# EAGLE design shield (EAGLE 8.3.2)

## Sheet 1 of 2
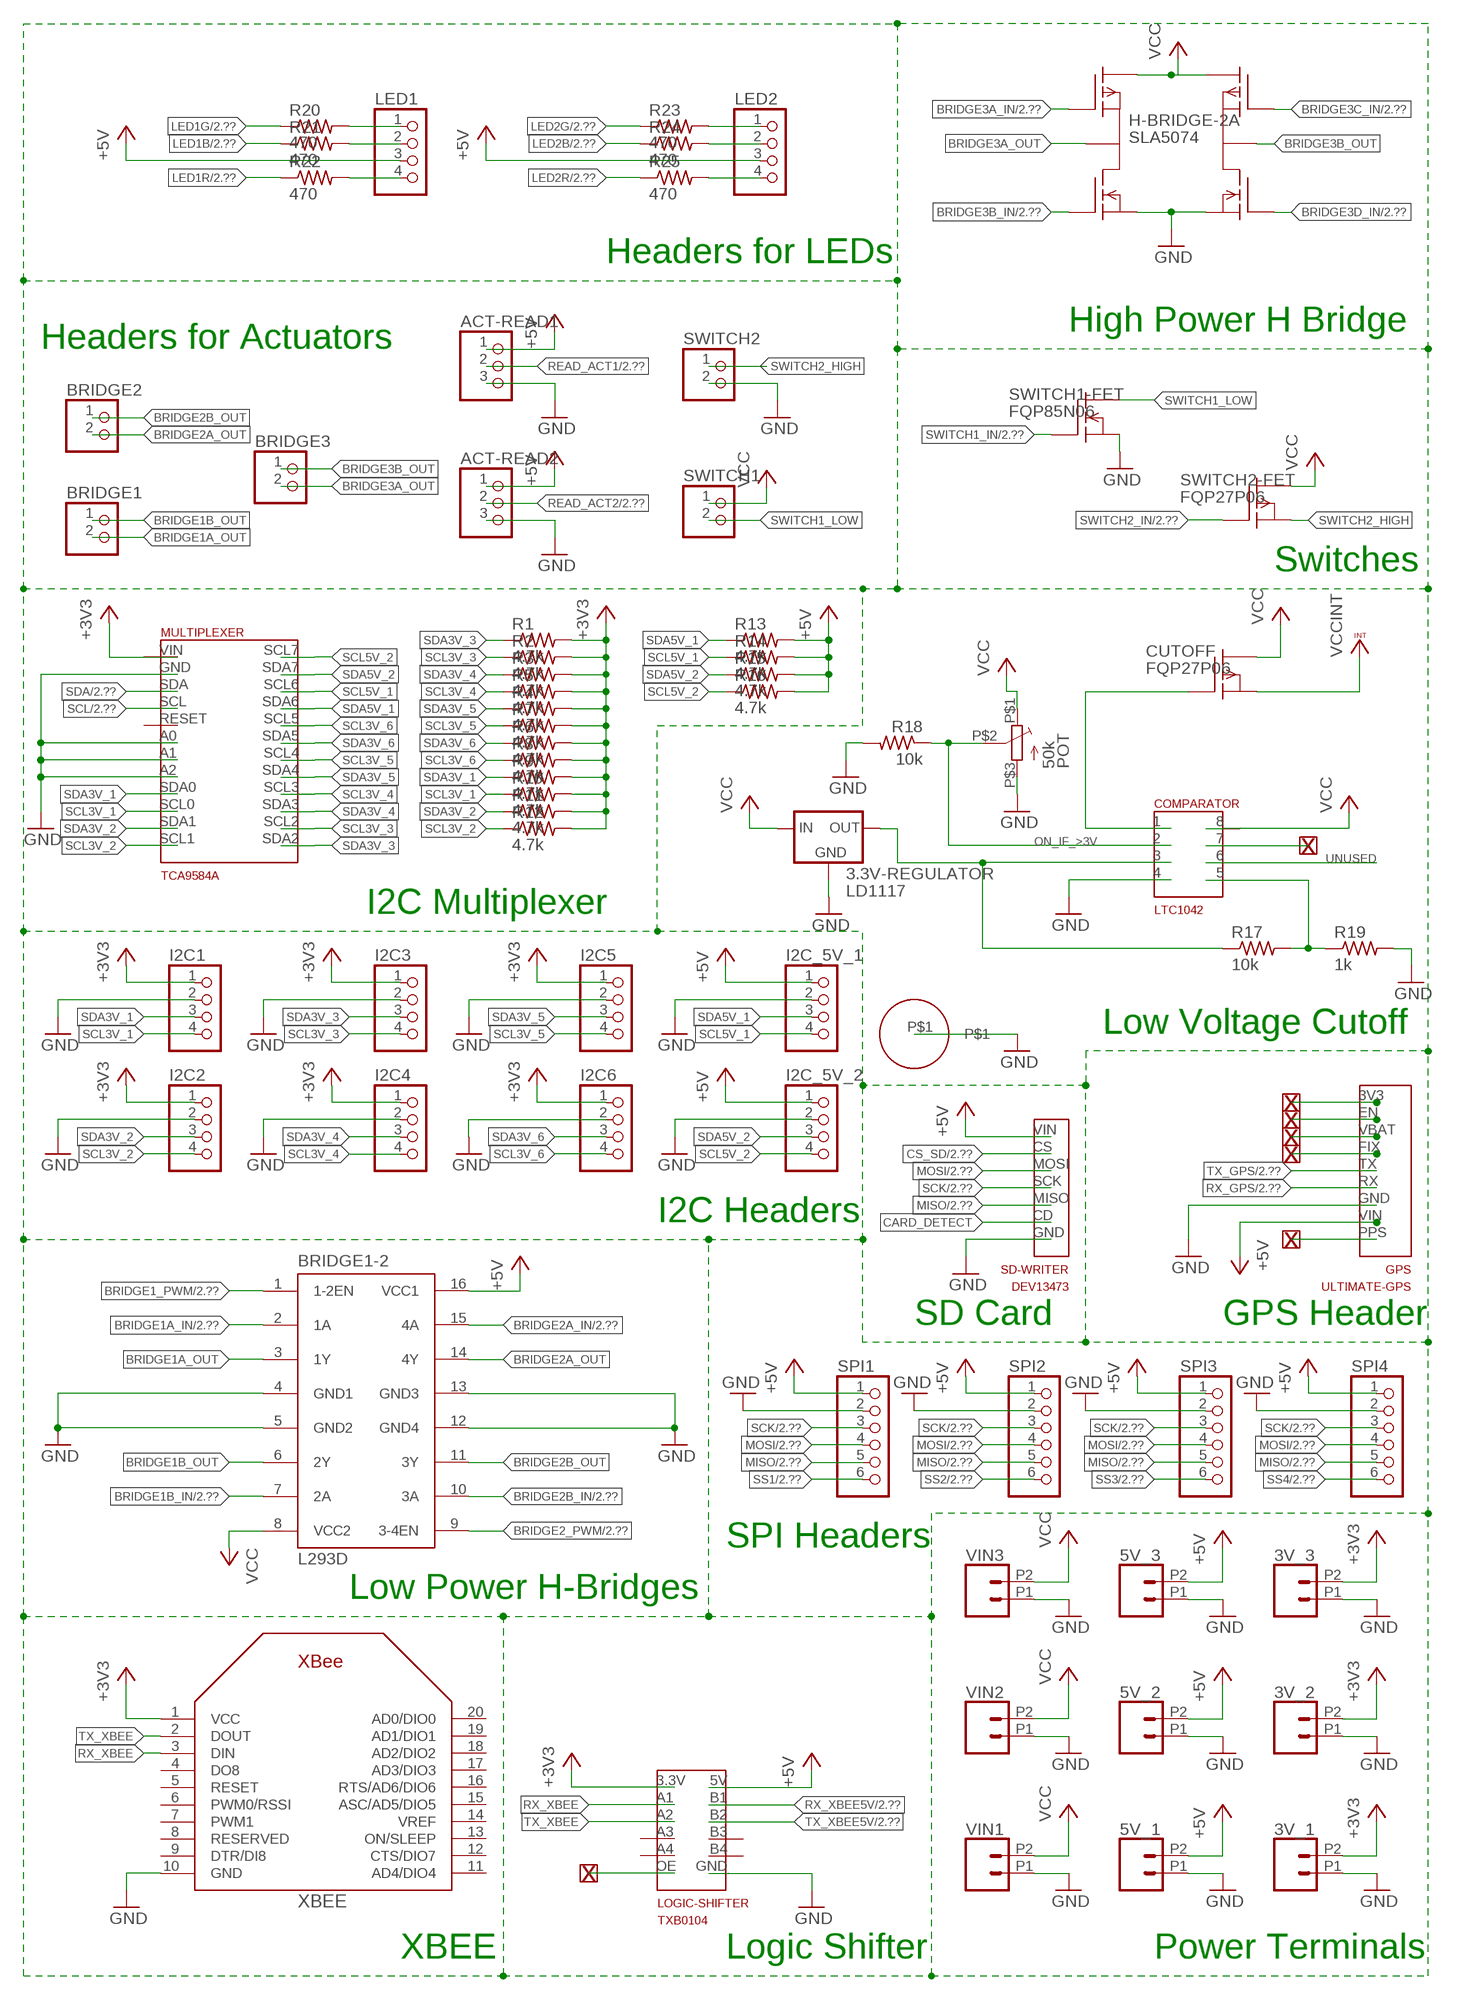
[diagram p0: schematic, sheet 1]

### Parts
3.3V-REGULATOR  LD1117  [REGULATOR]
3V_1  CONN_022.54MM_SCREWTERM  [1X02_2.54_SCREWTERM]
3V_2  CONN_022.54MM_SCREWTERM  [1X02_2.54_SCREWTERM]
3V_3  CONN_022.54MM_SCREWTERM  [1X02_2.54_SCREWTERM]
5V_1  CONN_022.54MM_SCREWTERM  [1X02_2.54_SCREWTERM]
5V_2  CONN_022.54MM_SCREWTERM  [1X02_2.54_SCREWTERM]
5V_3  CONN_022.54MM_SCREWTERM  [1X02_2.54_SCREWTERM]
ACT-READ1  PINHD-1X3  [1X03]
ACT-READ2  PINHD-1X3  [1X03]
BRIDGE1  PINHD-1X2  [1X02]
BRIDGE1-2  L293D  [DIL16]
BRIDGE2  PINHD-1X2  [1X02]
BRIDGE3  PINHD-1X2  [1X02]
COMPARATOR  LTC1042  [DIP8]
CUTOFF  FQP27P06  [MOSFET]
GPS  ULTIMATE-GPS  [GPS]
H-BRIDGE-2A  SLA5074  [SANKEN]
I2C1  PINHD-1X4  [1X04]
I2C2  PINHD-1X4  [1X04]
I2C3  PINHD-1X4  [1X04]
I2C4  PINHD-1X4  [1X04]
I2C5  PINHD-1X4  [1X04]
I2C6  PINHD-1X4  [1X04]
I2C_5V_1  PINHD-1X4  [1X04]
I2C_5V_2  PINHD-1X4  [1X04]
LED1  PINHD-1X4  [1X04]
LED2  PINHD-1X4  [1X04]
LOGIC-SHIFTER  TXB0104  [TXB0104]
MULTIPLEXER  TCA9584A  [TCA9584A]
POT  50k  PV37W503C01B00  [PV37W503C01B00]
R1  4.7k  R-US_FLIPFLOP  [0805-THM]
R2  4.7k  R-US_FLIPFLOP  [0805-THM]
R3  4.7k  R-US_FLIPFLOP  [0805-THM]
R4  4.7k  R-US_FLIPFLOP  [0805-THM]
R5  4.7k  R-US_FLIPFLOP  [0805-THM]
R6  4.7k  R-US_FLIPFLOP  [0805-THM]
R7  4.7k  R-US_FLIPFLOP  [0805-THM]
R8  4.7k  R-US_FLIPFLOP  [0805-THM]
R9  4.7k  R-US_FLIPFLOP  [0805-THM]
R10  4.7k  R-US_FLIPFLOP  [0805-THM]
R11  4.7k  R-US_FLIPFLOP  [0805-THM]
R12  4.7k  R-US_FLIPFLOP  [0805-THM]
R13  4.7k  R-US_FLIPFLOP  [0805-THM]
R14  4.7k  R-US_FLIPFLOP  [0805-THM]
R15  4.7k  R-US_FLIPFLOP  [0805-THM]
R16  4.7k  R-US_FLIPFLOP  [0805-THM]
R17  10k  R-US_FLIPFLOP  [0805-THM]
R18  10k  R-US_FLIPFLOP  [0805-THM]
R19  1k  R-US_FLIPFLOP  [0805-THM]
R20  470  R-US_FLIPFLOP  [0805-THM]
R21  470  R-US_FLIPFLOP  [0805-THM]
R22  470  R-US_FLIPFLOP  [0805-THM]
R23  470  R-US_FLIPFLOP  [0805-THM]
R24  470  R-US_FLIPFLOP  [0805-THM]
R25  470  R-US_FLIPFLOP  [0805-THM]
SD-WRITER  DEV13473  [DEV13743]
SPI1  PINHD-1X6  [1X06]
SPI2  PINHD-1X6  [1X06]
SPI3  PINHD-1X6  [1X06]
SPI4  PINHD-1X6  [1X06]
SWITCH1  PINHD-1X2  [1X02]
SWITCH1-FET  FQP85N06  [MOSFET]
SWITCH2  PINHD-1X2  [1X02]
SWITCH2-FET  FQP27P06  [MOSFET]
U$1  6BOLT  [6BOLT]
VIN1  CONN_022.54MM_SCREWTERM  [1X02_2.54_SCREWTERM]
VIN2  CONN_022.54MM_SCREWTERM  [1X02_2.54_SCREWTERM]
VIN3  CONN_022.54MM_SCREWTERM  [1X02_2.54_SCREWTERM]
XBEE  XBEE  [XBEE]

### Nets
0.3V: COMPARATOR.5(WIDTH/2) R17.2 R19.1
+3V3: 3V_1.P2 3V_2.P2 3V_3.P2 I2C1.1 I2C2.1 I2C3.1 I2C4.1 I2C5.1 I2C6.1 LOGIC-SHIFTER.3.3V(3V3) MULTIPLEXER.VIN R1.2 R2.2 R3.2 R4.2 R5.2 R6.2 R7.2 R8.2 R9.2 R10.2 R11.2 R12.2 XBEE.1(VCC) ; also sheet 2
+5V: 5V_1.P2 5V_2.P2 5V_3.P2 ACT-READ1.1 ACT-READ2.1 BRIDGE1-2.16(VCC1) GPS.VIN I2C_5V_1.1 I2C_5V_2.1 LED1.3 LED2.3 LOGIC-SHIFTER.5V R13.2 R14.2 R15.2 R16.2 SD-WRITER.VIN SPI1.1 SPI2.1 SPI3.1 SPI4.1 ; also sheet 2
BRIDGE1_PWM: BRIDGE1-2.1(1-2EN) ; also sheet 2
BRIDGE1A_IN: BRIDGE1-2.2(1A) ; also sheet 2
BRIDGE1A_OUT: BRIDGE1-2.3(1Y) BRIDGE1.2
BRIDGE1B_IN: BRIDGE1-2.7(2A) ; also sheet 2
BRIDGE1B_OUT: BRIDGE1-2.6(2Y) BRIDGE1.1
BRIDGE2_PWM: BRIDGE1-2.9(3-4EN) ; also sheet 2
BRIDGE2A_IN: BRIDGE1-2.15(4A) ; also sheet 2
BRIDGE2A_OUT: BRIDGE1-2.14(4Y) BRIDGE2.2
BRIDGE2B_IN: BRIDGE1-2.10(3A) ; also sheet 2
BRIDGE2B_OUT: BRIDGE1-2.11(3Y) BRIDGE2.1
BRIDGE3A_IN: H-BRIDGE-2A.P$4 ; also sheet 2
BRIDGE3A_OUT: BRIDGE3.2 H-BRIDGE-2A.P$3
BRIDGE3B_IN: H-BRIDGE-2A.P$2 ; also sheet 2
BRIDGE3B_OUT: BRIDGE3.1 H-BRIDGE-2A.P$7
BRIDGE3C_IN: H-BRIDGE-2A.P$9 ; also sheet 2
BRIDGE3D_IN: H-BRIDGE-2A.P$6 ; also sheet 2
CARD_DETECT: SD-WRITER.CD
CS_SD: SD-WRITER.CS ; also sheet 2
GND: 3.3V-REGULATOR.GND 3V_1.P1 3V_2.P1 3V_3.P1 5V_1.P1 5V_2.P1 5V_3.P1 ACT-READ1.3 ACT-READ2.3 BRIDGE1-2.4(GND1) BRIDGE1-2.5(GND2) BRIDGE1-2.12(GND4) BRIDGE1-2.13(GND3) COMPARATOR.4(GND) GPS.GND H-BRIDGE-2A.P$1 H-BRIDGE-2A.P$8 I2C1.2 I2C2.2 I2C3.2 I2C4.2 I2C5.2 I2C6.2 I2C_5V_1.2 I2C_5V_2.2 LOGIC-SHIFTER.GND MULTIPLEXER.A0 MULTIPLEXER.A1 MULTIPLEXER.A2 MULTIPLEXER.GND POT.P$3 R18.2 R19.2 SD-WRITER.GND SPI1.2 SPI2.2 SPI3.2 SPI4.2 SWITCH1-FET.S SWITCH2.2 U$1.P$1 VIN1.P1 VIN2.P1 VIN3.P1 XBEE.10(GND) ; also sheet 2
LED1B: R21.1 ; also sheet 2
LED1G: R20.1 ; also sheet 2
LED1R: R22.1 ; also sheet 2
LED2B: R24.1 ; also sheet 2
LED2G: R23.1 ; also sheet 2
LED2R: R25.1 ; also sheet 2
MISO: SD-WRITER.MISO SPI1.5 SPI2.5 SPI3.5 SPI4.5 ; also sheet 2
MOSI: SD-WRITER.MOSI SPI1.4 SPI2.4 SPI3.4 SPI4.4 ; also sheet 2
N$9: GPS.3V3
N$10: GPS.EN
N$11: GPS.VBAT
N$12: GPS.FIX
N$13: LOGIC-SHIFTER.OE
N$14: LED1.1 R20.2
N$15: COMPARATOR.7(OSC)
N$17: GPS.PPS
N$20: LED1.2 R21.2
N$21: LED1.4 R22.2
N$22: LED2.1 R23.2
N$23: LED2.2 R24.2
N$24: LED2.4 R25.2
ON_IF_>3V: COMPARATOR.2(CENTER) POT.P$2 R18.1
POWER-ON: COMPARATOR.1(WITHIN-WINDOW) CUTOFF.G
READ_ACT1: ACT-READ1.2 ; also sheet 2
READ_ACT2: ACT-READ2.2 ; also sheet 2
REG-3V3: 3.3V-REGULATOR.VOUT COMPARATOR.3(VIN) R17.1
RX_GPS: GPS.RX ; also sheet 2
RX_XBEE: LOGIC-SHIFTER.A1 XBEE.3(DIN)
RX_XBEE5V: LOGIC-SHIFTER.B1 ; also sheet 2
SCK: SD-WRITER.SCK SPI1.3 SPI2.3 SPI3.3 SPI4.3 ; also sheet 2
SCL: MULTIPLEXER.SCL ; also sheet 2
SCL3V_1: I2C1.4 MULTIPLEXER.SCL0 R10.1
SCL3V_2: I2C2.4 MULTIPLEXER.SCL1 R12.1
SCL3V_3: I2C3.4 MULTIPLEXER.SCL2 R2.1
SCL3V_4: I2C4.4 MULTIPLEXER.SCL3 R5.1
SCL3V_5: I2C5.4 MULTIPLEXER.SCL4 R7.1
SCL3V_6: I2C6.4 MULTIPLEXER.SCL5 R8.1
SCL5V_1: I2C_5V_1.4 MULTIPLEXER.SCL6 R14.1
SCL5V_2: I2C_5V_2.4 MULTIPLEXER.SCL7 R16.1
SDA: MULTIPLEXER.SDA ; also sheet 2
SDA3V_1: I2C1.3 MULTIPLEXER.SDA0 R9.1
SDA3V_2: I2C2.3 MULTIPLEXER.SDA1 R11.1
SDA3V_3: I2C3.3 MULTIPLEXER.SDA2 R1.1
SDA3V_4: I2C4.3 MULTIPLEXER.SDA3 R3.1
SDA3V_5: I2C5.3 MULTIPLEXER.SDA4 R4.1
SDA3V_6: I2C6.3 MULTIPLEXER.SDA5 R6.1
SDA5V_1: I2C_5V_1.3 MULTIPLEXER.SDA6 R13.1
SDA5V_2: I2C_5V_2.3 MULTIPLEXER.SDA7 R15.1
SS1: SPI1.6 ; also sheet 2
SS2: SPI2.6 ; also sheet 2
SS3: SPI3.6 ; also sheet 2
SS4: SPI4.6 ; also sheet 2
SWITCH1_IN: SWITCH1-FET.G ; also sheet 2
SWITCH1_LOW: SWITCH1-FET.D SWITCH1.2
SWITCH2_HIGH: SWITCH2-FET.S SWITCH2.1
SWITCH2_IN: SWITCH2-FET.G ; also sheet 2
TX_GPS: GPS.TX ; also sheet 2
TX_XBEE: LOGIC-SHIFTER.A2 XBEE.2(DOUT)
TX_XBEE5V: LOGIC-SHIFTER.B2 ; also sheet 2
UNUSED: COMPARATOR.6(ABOVE-WINDOW)
VCC: 3.3V-REGULATOR.VIN BRIDGE1-2.8(VCC2) COMPARATOR.8(V+) CUTOFF.D H-BRIDGE-2A.P$5 H-BRIDGE-2A.P$10 POT.P$1 SWITCH1.1 SWITCH2-FET.D VIN1.P2 VIN2.P2 VIN3.P2
VCCINT: CUTOFF.S ; also sheet 2
Unconnected: LOGIC-SHIFTER.A3 LOGIC-SHIFTER.A4 LOGIC-SHIFTER.B3 LOGIC-SHIFTER.B4 MULTIPLEXER.RESET XBEE.4(DO8) XBEE.5(RESET) XBEE.6(PWM0/RSSI) XBEE.7(PWM1) XBEE.8(RESERVED) XBEE.9(DTR/DI8) XBEE.11(AD4/DIO4) XBEE.12(CTS/DIO7) XBEE.13(ON/SLEEP) XBEE.14(VREF) XBEE.15(ASC/AD5/DIO5) XBEE.16(RTS/AD6/DIO6) XBEE.17(AD3/DIO3) XBEE.18(AD2/DIO2) XBEE.19(AD1/DIO1) XBEE.20(AD0/DIO0)

### Notes on the sheet
- Headers for LEDs
- High Power H Bridge
- Headers for Actuators
- Switches
- I2C Multiplexer
- Low Voltage Cutoff
- I2C Headers
- SD Card | GPS Header
- SPI Headers
- Low Power H-Bridges
- XBEE | Logic Shifter | Power Terminals

## Sheet 2 of 2
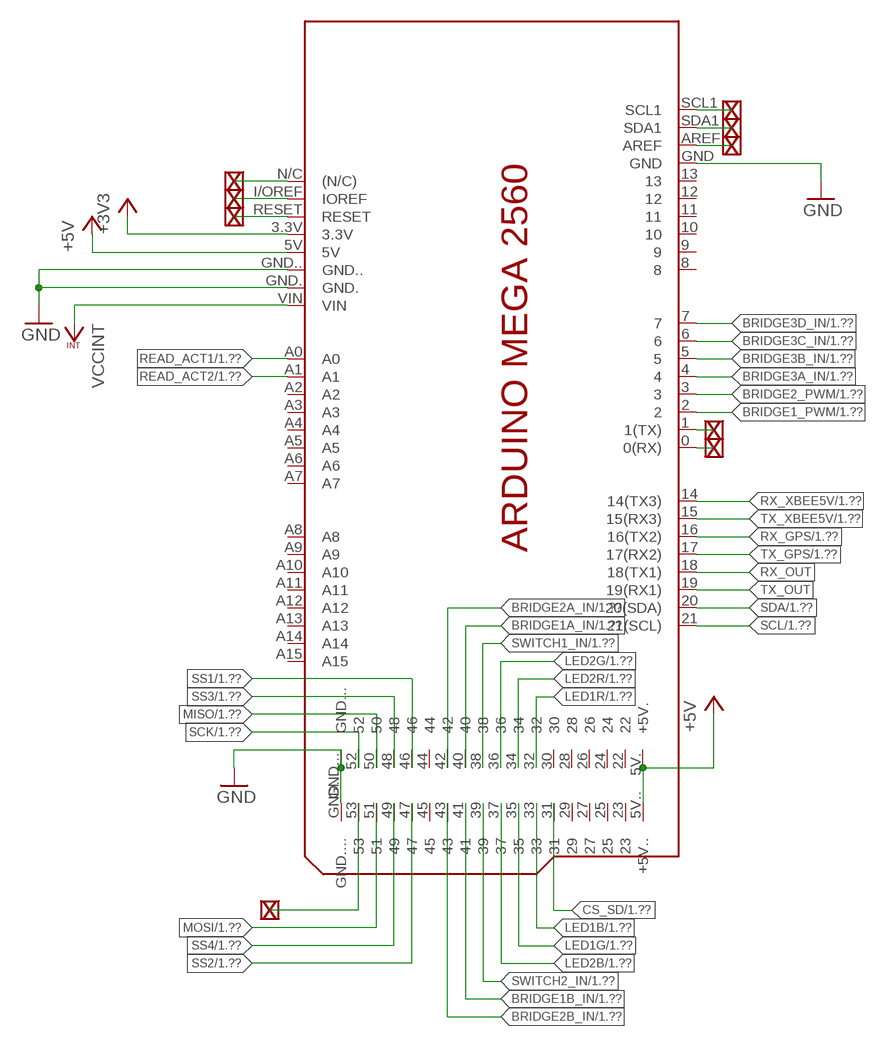
[diagram p1: schematic, sheet 2]

### Parts
PCB2  ARDUINO_MEGA2560_SHIELD  [ARDUINO_MEGA2560_SHIELD]

### Nets
+3V3: PCB2.3.3V ; also sheet 1
+5V: PCB2.5V PCB2.5V.(+5V.) PCB2.5V..(+5V..) ; also sheet 1
BRIDGE1_PWM: PCB2.2 ; also sheet 1
BRIDGE1A_IN: PCB2.40 ; also sheet 1
BRIDGE1B_IN: PCB2.41 ; also sheet 1
BRIDGE2_PWM: PCB2.3 ; also sheet 1
BRIDGE2A_IN: PCB2.42 ; also sheet 1
BRIDGE2B_IN: PCB2.43 ; also sheet 1
BRIDGE3A_IN: PCB2.4 ; also sheet 1
BRIDGE3B_IN: PCB2.5 ; also sheet 1
BRIDGE3C_IN: PCB2.6 ; also sheet 1
BRIDGE3D_IN: PCB2.7 ; also sheet 1
CS_SD: PCB2.31 ; also sheet 1
GND: PCB2.GND PCB2.GND. PCB2.GND.. PCB2.GND... PCB2.GND.... ; also sheet 1
LED1B: PCB2.33 ; also sheet 1
LED1G: PCB2.35 ; also sheet 1
LED1R: PCB2.32 ; also sheet 1
LED2B: PCB2.37 ; also sheet 1
LED2G: PCB2.36 ; also sheet 1
LED2R: PCB2.34 ; also sheet 1
MISO: PCB2.50 ; also sheet 1
MOSI: PCB2.51 ; also sheet 1
N$2: PCB2.0(0(RX))
N$3: PCB2.SCL1
N$4: PCB2.SDA1
N$5: PCB2.AREF
N$6: PCB2.N/C((N/C))
N$7: PCB2.I/OREF(IOREF)
N$8: PCB2.RESET
READ_ACT1: PCB2.A0 ; also sheet 1
READ_ACT2: PCB2.A1 ; also sheet 1
RESERVED: PCB2.1(1(TX))
RX_GPS: PCB2.16(16(TX2)) ; also sheet 1
RX_OUT: PCB2.18(18(TX1))
RX_XBEE5V: PCB2.14(14(TX3)) ; also sheet 1
SCK: PCB2.52 ; also sheet 1
SCL: PCB2.21(21(SCL)) ; also sheet 1
SDA: PCB2.20(20(SDA)) ; also sheet 1
SS1: PCB2.46 ; also sheet 1
SS2: PCB2.47 ; also sheet 1
SS3: PCB2.48 ; also sheet 1
SS4: PCB2.49 ; also sheet 1
SS_MASTER: PCB2.53
SWITCH1_IN: PCB2.38 ; also sheet 1
SWITCH2_IN: PCB2.39 ; also sheet 1
TX_GPS: PCB2.17(17(RX2)) ; also sheet 1
TX_OUT: PCB2.19(19(RX1))
TX_XBEE5V: PCB2.15(15(RX3)) ; also sheet 1
VCCINT: PCB2.VIN ; also sheet 1
Unconnected: PCB2.8 PCB2.9 PCB2.10 PCB2.11 PCB2.12 PCB2.13 PCB2.22 PCB2.23 PCB2.24 PCB2.25 PCB2.26 PCB2.27 PCB2.28 PCB2.29 PCB2.30 PCB2.44 PCB2.45 PCB2.A2 PCB2.A3 PCB2.A4 PCB2.A5 PCB2.A6 PCB2.A7 PCB2.A8 PCB2.A9 PCB2.A10 PCB2.A11 PCB2.A12 PCB2.A13 PCB2.A14 PCB2.A15

## Library data of the parts
3.3V-REGULATOR = specialparts:LD1117: 3.3V Regulator ST Microelectronics LD1117
3V_1-3V_3 5V_1-5V_3 VIN1-VIN3 = SparkFun-Connectors:CONN_02: Multi connection point. Often used as Generic Header-pin footprint for 0.1 inch spaced/style header connections On any of the 0.1 inch spaced packages, you can populate with these: Break Away Headers - Straight <https://www.sparkfun.com/products/116> (PRT-00116) Break Away Male Headers - Right Angle <https://www.sparkfun.com/products/553> (PRT-00553) Female Headers <https://www.sparkfun.com/products/115> (PRT-00115) Break Away Headers - Machine Pin <https://www.sparkfun.com/products/117> (PRT-00117) Break Away Female Headers - Swiss Machine Pin <https://www.sparkfun.com/products/743> (PRT-00743) For SCREWTERMINALS and SPRING TERMINALS visit here: Screw Terimnals on SparkFun.com <https://www.sparkfun.com/search/results?term=Screw+Terminals> (5mm/3.5mm/2.54mm spacing) This device is also useful as a general connection point to wire up your design to another part of your project. Our various solder wires solder well into these plated through hole pads. Hook-Up Wire - Assortment (Stranded, 22 AWG) <https://www.sparkfun.com/products/11375> (PRT-11375) Hook-Up Wire - Assortment (Solid Core, 22 AWG) <https://www.sparkfun.com/products/11367> (PRT-11367) View the entire wire category on our website here <https://www.sparkfun.com/categories/141> Special notes: Molex polarized connector foot print use with: PRT-08233 with associated crimp pins and housings. 2.54_SCREWTERM for use with PRT-10571. 3.5mm Screw Terminal footprints for PRT-08084 5mm Screw Terminal footprints for use with PRT-08432
ACT-READ1 ACT-READ2 = pinhead:PINHD-1X3: PIN HEADER
BRIDGE1-BRIDGE3 SWITCH1 SWITCH2 = pinhead:PINHD-1X2: PIN HEADER
BRIDGE1-2 = st-microelectronics:L293D: PUSH-PULL 4 CHANNEL DRIVER; MPN: L293D; OC_FARNELL: 9589619; OC_NEWARK: 56P8249
COMPARATOR = specialparts:LTC1042: Analog Comparator Linear Technologoies LTC1042
CUTOFF SWITCH2-FET = specialparts:FQP27P06: P Channel MOSFET Fairchild FQP27P06
GPS = specialparts:ULTIMATE-GPS: GPS Breakout Adafruit Ultimate GPS
H-BRIDGE-2A = specialparts:SLA5074
I2C1-I2C6 I2C_5V_1 I2C_5V_2 LED1 LED2 = pinhead:PINHD-1X4: PIN HEADER
LOGIC-SHIFTER = specialparts:TXB0104: Bidirectional Logic Shifter Adafruit TXB0104 Not suitable for I2C
MULTIPLEXER = specialparts:TCA9584A: I2C Multiplexer Breakout Board
PCB2 = E14_Arduino_revC:ARDUINO_MEGA2560_SHIELD: Device for representing an Arduino Mega 2560 board with a footprint in an EAGLE design. Created by Dave Young for Element14. More EAGLE documentation at: http://www.element14.com/community/community/knode/cadsoft_eagle
POT = specialparts:PV37W503C01B00: 50k potentiometer Bournes INC PV37W503C01B00
R1-R25 = adafruit:R-US_: RESISTOR, American symbol
SD-WRITER = specialparts:DEV13473: SD Card Writer Level Shifting SparkFun DEV13743
SPI1-SPI4 = pinhead:PINHD-1X6: PIN HEADER
SWITCH1-FET = specialparts:FQP85N06: N Channel MOSFET Fairchild FQP85N06
U$1 = specialparts:6BOLT: Hole for a size #6 bolt for ESD strap attachment.
XBEE = adafruit:XBEE

## Board
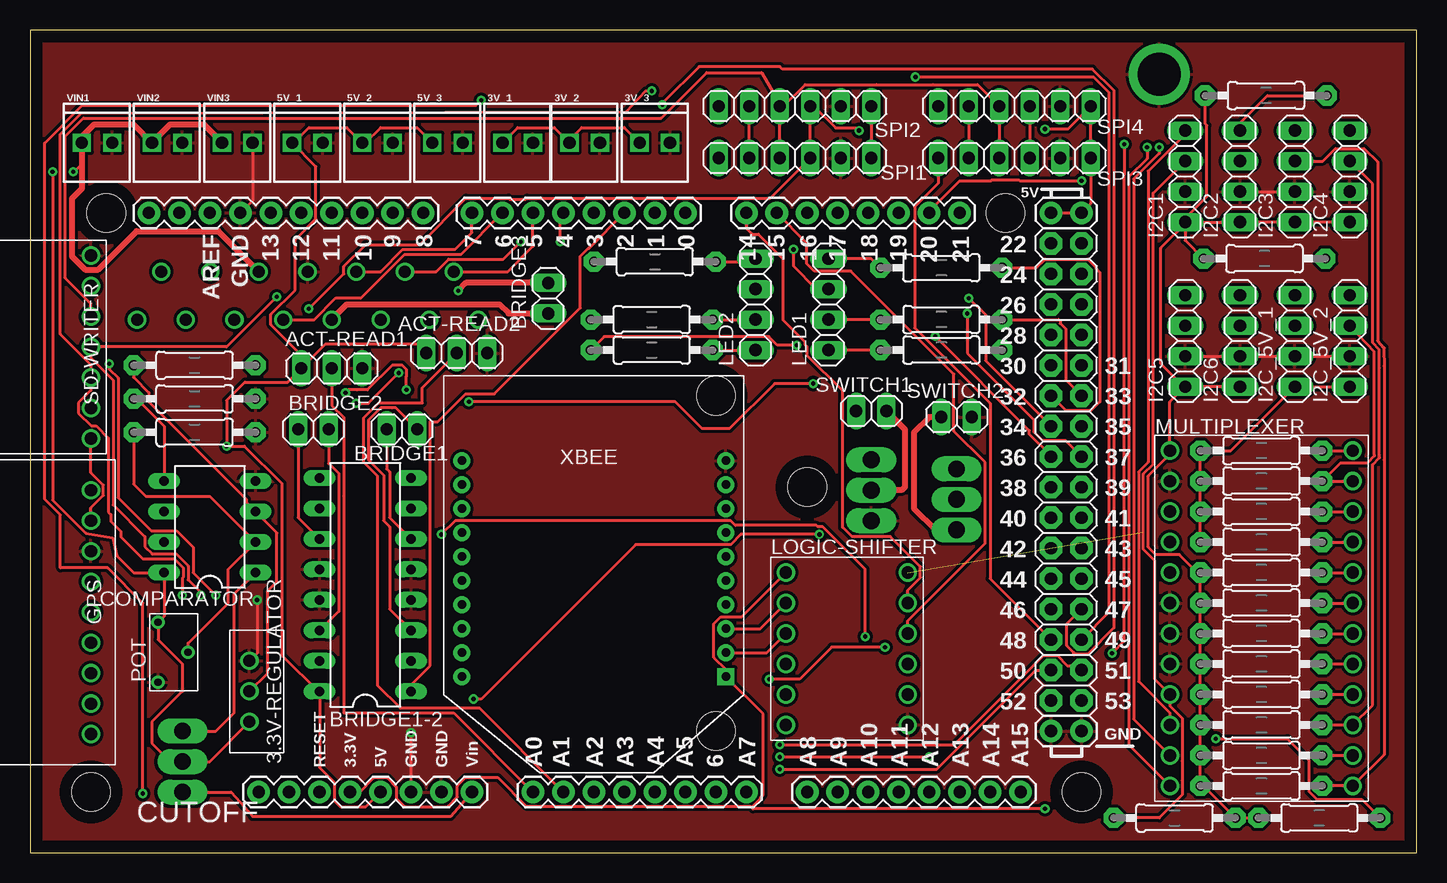
[diagram p2: board, top side]
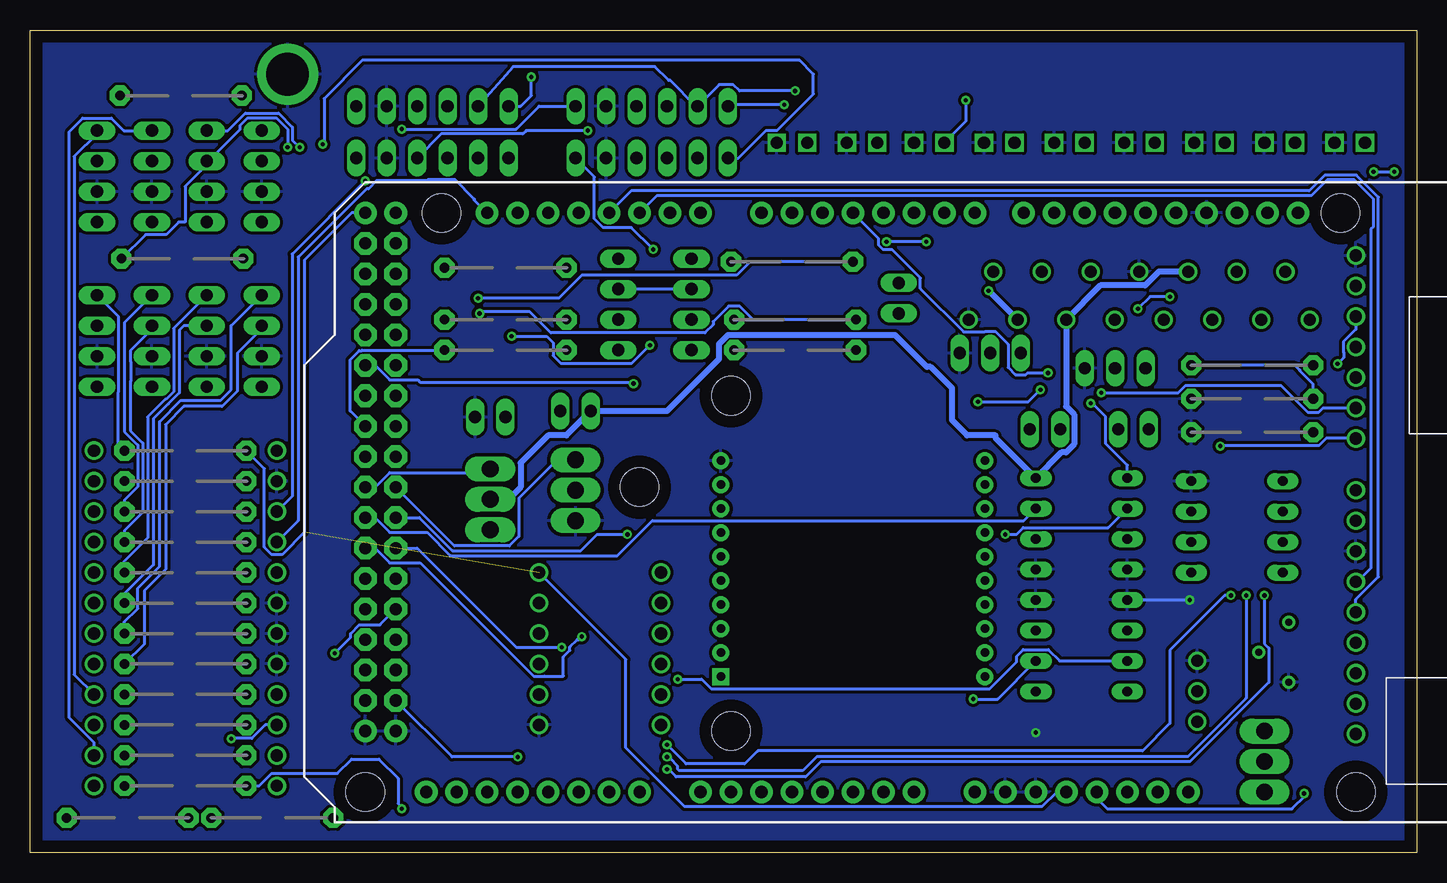
[diagram p3: board, bottom side, seen from below]

Size 115.57 x 68.58 mm. Coordinates in mm from the lower left corner, seen from the top.
Outline: 0,0 115.57,0 115.57,68.58 0,68.58 0,0
Copper layers (1*16): Top 0.035mm / dielectric 1.5mm / Bottom 0.035mm
Design rules "default": minimum track width 6mil, minimum drill 0.35mm, track to track 6mil, track to pad 6mil, pad to pad 6mil, via to via 6mil, smd to smd 6mil, copper to edge 40mil, drill to drill 6mil, minimum pad ring 10mil, minimum via ring 8mil, stop-mask expansion 4mil, vias tented up to drill 0mil, thermal gap 10mil

### Footprints (pad centres in the part's own frame; a part is rotated, then mirrored left to right if it is on the bottom)
REGULATOR = drill 1: GND 0,0; VIN 5.08,0; VOUT 2.54,0
1X02_2.54_SCREWTERM = drill 1.016 square: P1 2.54,0; P2 0,0
1X03 = drill 1.016 long: 1 -2.54,0; 2 0,0; 3 2.54,0
1X02 = drill 1.016 long: 1 -1.27,0; 2 1.27,0
DIL16 = drill 0.813 long: 1 -8.89,-3.81; 2 -6.35,-3.81; 3 -3.81,-3.81; 4 -1.27,-3.81; 5 1.27,-3.81; 6 3.81,-3.81; 7 6.35,-3.81; 8 8.89,-3.81; 9 8.89,3.81; 10 6.35,3.81; 11 3.81,3.81; 12 1.27,3.81; 13 -1.27,3.81; 14 -3.81,3.81; 15 -6.35,3.81; 16 -8.89,3.81
DIP8 = drill 0.813 long: 1 -1.27,-2.54; 2 1.27,-2.54; 3 3.81,-2.54; 4 6.35,-2.54; 5 6.35,5.08; 6 3.81,5.08; 7 1.27,5.08; 8 -1.27,5.08
MOSFET = drill 1.4 long: D 0,2.54; G 0,5.08; S 0,0
GPS = drill 1.016: 3V3 0,0; EN 2.54,0; FIX 7.62,0; GND 15.24,0; PPS 20.32,0; RX 12.7,0; TX 10.16,0; VBAT 5.08,0; VIN 17.78,0
SANKEN = drill 1: P$1 0,0; P$2 4,2.03; P$3 0,4.06; P$4 4,6.09; P$5 0,8.12; P$6 4,10.15; P$7 0,12.18; P$8 4,14.21; P$9 0,16.24; P$10 4,18.27; P$11 0,20.3; P$12 4,22.33; P$13 0,24.36; P$14 4,26.39; P$15 0,28.42
1X04 = drill 1.016 long: 1 -3.81,0; 2 -1.27,0; 3 1.27,0; 4 3.81,0
TXB0104 = drill 1.016: 3.3V -5.08,12.7; 5V 5.08,12.7; A1 -5.08,10.16; A2 -5.08,7.62; A3 -5.08,5.08; A4 -5.08,2.54; B1 5.08,10.16; B2 5.08,7.62; B3 5.08,5.08; B4 5.08,2.54; GND 5.08,0; OE -5.08,0
TCA9584A = drill 1.016: A0 -7.62,15.24; A1 -7.62,12.7; A2 -7.62,10.16; GND -7.62,25.4; RESET -7.62,17.78; SCL -7.62,20.32; SCL0 -7.62,5.08; SCL1 -7.62,0; SCL2 7.62,2.54; SCL3 7.62,7.62; SCL4 7.62,12.7; SCL5 7.62,17.78; SCL6 7.62,22.86; SCL7 7.62,27.94; SDA -7.62,22.86; SDA0 -7.62,7.62; SDA1 -7.62,2.54; SDA2 7.62,0; SDA3 7.62,5.08; SDA4 7.62,10.16; SDA5 7.62,15.24; SDA6 7.62,20.32; SDA7 7.62,25.4; VIN -7.62,27.94
ARDUINO_MEGA2560_SHIELD = drill 1.016 pad 1.88: 0 63.5,50.8; 1 60.96,50.8; 2 58.42,50.8; 3 55.88,50.8; 3.3V 35.56,2.54; 4 53.34,50.8; 5 50.8,50.8; 5V 38.1,2.54; 5V. 93.98,50.8; 5V.. 96.52,50.8; 6 48.26,50.8; 7 45.72,50.8; 8 41.656,50.8; 9 39.116,50.8; 10 36.576,50.8; 11 34.036,50.8; 12 31.496,50.8; 13 28.956,50.8; 14 68.58,50.8; 15 71.12,50.8; 16 73.66,50.8; 17 76.2,50.8; 18 78.74,50.8; 19 81.28,50.8; 20 83.82,50.8; 21 86.36,50.8; A0 50.8,2.54; A1 53.34,2.54; A2 55.88,2.54; A3 58.42,2.54; A4 60.96,2.54; A5 63.5,2.54; A6 66.04,2.54; A7 68.58,2.54; A8 73.66,2.54; A9 76.2,2.54; A10 78.74,2.54; A11 81.28,2.54; A12 83.82,2.54; A13 86.36,2.54; A14 88.9,2.54; A15 91.44,2.54; AREF 23.876,50.8; GND 26.416,50.8; GND. 43.18,2.54; GND.. 40.64,2.54; GND... 93.98,7.62; GND.... 96.52,7.62; I/OREF 30.48,2.54; N/C 27.94,2.54; RESET 33.02,2.54; SCL1 18.796,50.8; SDA1 21.336,50.8; VIN 45.72,2.54 | drill 1.016 pad 1.88 octagon: 22 93.98,48.26; 23 96.52,48.26; 24 93.98,45.72; 25 96.52,45.72; 26 93.98,43.18; 27 96.52,43.18; 28 93.98,40.64; 29 96.52,40.64; 30 93.98,38.1; 31 96.52,38.1; 32 93.98,35.56; 33 96.52,35.56; 34 93.98,33.02; 35 96.52,33.02; 36 93.98,30.48; 37 96.52,30.48; 38 93.98,27.94; 39 96.52,27.94; 40 93.98,25.4; 41 96.52,25.4; 42 93.98,22.86; 43 96.52,22.86; 44 93.98,20.32; 45 96.52,20.32; 46 93.98,17.78; 47 96.52,17.78; 48 93.98,15.24; 49 96.52,15.24; 50 93.98,12.7; 51 96.52,12.7; 52 93.98,10.16; 53 96.52,10.16 | hole 3.2: 15.24,50.8; 13.97,2.54; 66.04,35.56; 66.04,7.62; 90.17,50.8; 96.52,2.54; 73.66,27.94
PV37W503C01B00 = drill 0.6: P$1 5,0; P$2 2.5,-2.5; P$3 0,0
0805-THM = drill 0.813 pad 1.676 octagon: 1 -5.08,0; 2 5.08,0
DEV13743 = drill 1.016: CD 12.7,0; CS 2.54,0; GND 15.24,0; MISO 5.08,0; MOSI 10.16,0; SCK 7.62,0; VIN 0,0
1X06 = drill 1.016 long: 1 -6.35,0; 2 -3.81,0; 3 -1.27,0; 4 1.27,0; 5 3.81,0; 6 6.35,0
6BOLT = drill 3.556 pad 5.08: P$1 0,0
XBEE = drill 0.7 pad 1.422 square: 1 -11,5.5 | drill 0.7 pad 1.422: 2 -11,3.5; 3 -11,1.5; 4 -11,-0.5; 5 -11,-2.5; 6 -11,-4.5; 7 -11,-6.5; 8 -11,-8.5; 9 -11,-10.5; 10 -11,-12.5; 11 11,-12.5; 12 11,-10.5; 13 11,-8.5; 14 11,-6.5; 15 11,-4.5; 16 11,-2.5; 17 11,-0.5; 18 11,1.5; 19 11,3.5; 20 11,5.5

### Placement (x,y rotation side)
3.3V-REGULATOR  18.29,16 270 top
3V_1  39.37,59.18 0 top
3V_2  44.96,59.18 0 top
3V_3  50.8,59.18 0 top
5V_1  21.84,59.18 0 top
5V_2  27.69,59.18 0 top
5V_3  33.53,59.18 0 top
ACT-READ1  25.15,40.39 0 top
ACT-READ2  35.56,41.66 0 top
BRIDGE1  30.99,35.31 0 top
BRIDGE1-2  27.94,22.35 90 top
BRIDGE2  23.62,35.31 0 top
BRIDGE3  43.18,46.23 90 top
COMPARATOR  16.26,24.64 90 top
CUTOFF  12.7,5.08 0 top
GPS  5.08,9.91 90 top
H-BRIDGE-2A  37.34,44.45 90 top
I2C1  96.27,56.39 90 top
I2C2  100.84,56.39 90 top
I2C3  105.41,56.39 90 top
I2C4  109.98,56.39 90 top
I2C5  96.27,42.67 90 top
I2C6  100.84,42.67 90 top
I2C_5V_1  105.41,42.67 90 top
I2C_5V_2  109.98,42.67 90 top
LED1  66.55,45.72 90 top
LED2  60.45,45.72 90 top
LOGIC-SHIFTER  68.07,10.67 0 top
MULTIPLEXER  102.62,5.59 0 top
PCB2  -8.89,2.54 0 top
POT  10.67,14.22 90 top
R1  102.62,5.59 180 top
R2  102.62,8.13 180 top
R3  102.62,10.67 180 top
R4  102.62,15.75 180 top
R5  102.62,13.21 180 top
R6  102.62,20.83 180 top
R7  102.62,18.29 180 top
R8  102.62,23.37 180 top
R9  95.38,2.92 0 top
R10  107.44,2.92 180 top
R11  102.87,49.53 180 top
R12  103,63.12 180 top
R13  102.62,25.91 180 top
R14  102.62,28.45 180 top
R15  102.62,30.99 180 top
R16  102.62,33.53 180 top
R17  13.72,40.64 0 top
R18  13.72,35.05 0 top
R19  13.72,37.85 0 top
R20  75.95,41.91 180 top
R21  75.95,44.45 180 top
R22  75.95,48.77 180 top
R23  51.82,41.91 0 top
R24  51.82,44.45 0 top
R25  52.07,49.28 0 top
SD-WRITER  5.08,34.54 90 top
SPI1  63.75,57.91 180 top
SPI2  63.75,62.23 180 top
SPI3  82.04,57.91 180 top
SPI4  82.04,62.23 180 top
SWITCH1  70.1,36.83 0 top
SWITCH1-FET  70.1,27.69 0 top
SWITCH2  77.22,36.32 0 top
SWITCH2-FET  77.22,26.92 0 top
U$1  94.11,64.9 0 top
VIN1  4.32,59.18 0 top
VIN2  10.16,59.18 0 top
VIN3  16,59.18 0 top
XBEE  46.99,20.19 180 top

### Tracks (layer width: path | path; a pad name or v marks a point on that pad's centre or on a via)
0.3V
  Top 0.254: R19.1 8.89,37.85 11.18,35.56 COMPARATOR.5
  Bottom 0.254: R19.1 8.64,39.06 9.75,40.18 9.75,40.23 10.16,40.64 R17.2
+3V3  (via drill 0.35)
  Top 0.254: I2C6.1 I2C5.1 | I2C5.1 95,37.59 MULTIPLEXER.VIN 95,33.22 93.19,31.42 93.19,25.48 93.8,24.87 95.78,24.87 97.28,23.37 R8.2 R6.2 R7.2 R4.2 R5.2 R3.2 R2.2 R1.2 97.79,5.59 R9.2 R10.2 | I2C4.1 I2C3.1 I2C2.1 96.39,52.58 | 96.39,52.58 I2C1.1 | I2C5.1 96.14,38.86 94.23,40.77 94.23,50.42 96.39,52.58 | I2C1.1 96.27,52.88 98.07,54.69 98.07,60.63 97.92,60.78 R12.2 | I2C1.1 96.27,51.05 R11.2 | 3V_1.P2 40.64,60.45 43.69,60.45 3V_2.P2 44.96,59.44 45.97,60.45 49.53,60.45 3V_3.P2 | v9.4,4.95 9.4,20.83 6.48,23.75 2.54,23.75 2.54,28.18 1.23,29.49 1.23,59.16 4.37,62.31 37.16,62.31 v37.59,62.74 | LOGIC-SHIFTER.3.3V 59.31,19.68 57.58,19.68 57,19.1 57,16.28 57.99,15.29 XBEE.1 61.09,11.6 61.09,4.83 60.91,4.65 60.91,4.57 60.2,3.86 60.07,3.86 | PCB2.3.3V 27.49,5.08 28.71,6.3 29.71,6.3 30.53,5.48 30.53,4.57 31.24,3.86 34.79,3.86 35.61,4.68 35.61,5.59 36.32,6.3 38.97,6.3 41.4,3.86 60.07,3.86 | v84.58,3.68 60.25,3.68 60.07,3.86
  Bottom 0.254: PCB2.3.3V 26.67,4.57 25.78,3.68 10.41,3.68 9.27,4.83 v9.4,4.95 | v37.59,62.74 37.59,60.96 3V_1.P2 | R1.2 96.47,5.59 95.43,6.63 89.96,6.63 88.77,7.82 86.49,7.82 84.89,6.22 84.89,4.11 84.71,3.94 84.71,3.81 v84.58,3.68
+5V  (via drill 0.35)  (1 unrouted)
  Top 0.254: 24.13,13.33 BRIDGE1-2.16 | 24.13,13.33 24.13,7.11 25.4,5.84 25.4,4.32 25.91,3.81 27.94,3.81 PCB2.5V | SPI2.1 SPI1.1 | PCB2.5V. PCB2.5V.. 88.39,54.1 SPI3.1 SPI4.1 86.49,60.33 v84.58,60.33 | R13.2 R14.2 R15.2 R16.2 100.08,33.53 I2C_5V_1.1 I2C_5V_2.1 | 5V_3.P2 32.26,60.45 29.21,60.45 27.94,59.18 5V_2.P2 26.42,60.45 23.24,60.45 21.97,59.18 5V_1.P2 23.82,57.2 23.82,52.84 22.1,51.1 22.1,46.91 20.06,44.88 20.06,44.02 22.61,41.48 ACT-READ1.1 | ACT-READ1.1 24.64,42.42 32.26,42.42 ACT-READ2.1 | ACT-READ1.1 21.46,39.24 17.91,39.24 16.38,37.72 v16.38,33.91 17.86,33.91 20.98,30.79 20.98,16.48 24.13,13.33 | GPS.VIN 5.08,28.75 6.12,29.79 6.12,30.66 5.08,31.7 SD-WRITER.VIN | LED1.3 65.53,46.99 63.63,48.89 v63.63,50.29
  Bottom 0.254: PCB2.5V.. 88.77,53.34 92.71,49.4 92.71,26.72 94.56,24.87 95.43,24.87 96.04,25.48 96.04,32.03 R16.2 | SD-WRITER.VIN 7.56,34.54 8.17,33.93 16.36,33.93 v16.38,33.91 | v84.58,60.33 75.06,60.33 73.15,62.23 SPI2.1 | PCB2.5V 30.03,5.08 31.24,3.86 61.01,3.86 65.91,8.76 65.91,16.13 LOGIC-SHIFTER.5V | LED2.3 LED1.3 | SPI1.1 68.53,56.34 68.53,52.84 67.81,52.12 65.46,52.12 v63.63,50.29
BRIDGE1_PWM
  Top 0.254: PCB2.2 46.58,50.39 46.53,50.39 45.87,49.74 45.87,45.42 38.71,38.25 36.3,38.25 33.99,35.94 33.35,35.94 33.35,15.61 31.75,14.01 BRIDGE1-2.1
BRIDGE1A_IN  (via drill 0.35)
  Top 0.254: v65.79,26.54 59.24,26.54 58.4,25.7 50.47,25.7 37.59,12.83 v36.96,12.83
  Bottom 0.254: PCB2.40 83.12,27.94 80.37,25.19 69.67,25.19 68.32,26.54 v65.79,26.54 | v36.96,12.83 34.93,12.83 BRIDGE1-2.2
BRIDGE1A_OUT
  Top 0.254: BRIDGE1.2 30.48,37.08 30.18,37.08 30.15,37.11 29.24,37.11 28.19,36.07 28.19,32.77 29.46,31.5 29.46,27.69 29.97,27.18 29.97,20.32 BRIDGE1-2.3
BRIDGE1B_IN
  Bottom 0.254: PCB2.41 86.81,27.94 85.59,26.72 82.48,26.72 80.54,24.78 66.62,24.78 63.7,27.7 32.75,27.7 BRIDGE1-2.7
BRIDGE1B_OUT
  Top 0.254: BRIDGE1.1 29.72,32 29.97,31.75 29.97,27.94 BRIDGE1-2.6
BRIDGE2_PWM  (via drill 0.35)
  Top 0.254: v27.18,37.47 28.19,37.47 v30.73,40
  Bottom 0.254: BRIDGE1-2.9 24.13,32.31 25.93,34.11 25.93,36.35 27.05,37.47 v27.18,37.47 | PCB2.3 44.85,51.2 44.85,50.66 44.47,50.27 43.72,50.27 41.38,47.93 41.38,47.03 37.77,43.42 36.03,43.42 35.99,43.46 35.13,43.46 34.06,42.39 34.06,40.46 33.45,39.85 32.59,39.85 32.44,40 v30.73,40
BRIDGE2A_IN  (via drill 0.35)
  Top 0.254: v71.25,17.14 66.8,17.14 64.13,14.48 v61.6,14.48
  Bottom 0.254: PCB2.42 83.31,25.4 75.06,17.14 v71.25,17.14 | v61.6,14.48 59.59,14.48 58.82,13.7 35.58,13.7 33.35,15.93 33.35,16.39 32.8,16.94 30.7,16.94 29.76,16 BRIDGE1-2.15
BRIDGE2A_OUT
  Top 0.254: BRIDGE2.2 24.89,32.47 25.73,31.63 25.73,20.14 BRIDGE1-2.14
BRIDGE2B_IN  (via drill 0.35)
  Top 0.254: v69.6,18.03 69.6,23.66 66.06,27.2 65.64,27.2 65.53,27.3 58.78,27.3 58.4,27.68 35.43,27.68 v34.29,26.54
  Bottom 0.254: PCB2.43 86.81,25.4 85.59,24.18 83.06,24.18 73.58,14.71 72.72,14.71 72.69,14.73 71.12,14.73 71.12,16.34 70.59,16.87 70.59,17.17 69.98,17.78 69.85,17.78 v69.6,18.03 | v34.29,26.54 33.36,26.54 32.8,27.1 25.73,27.1 BRIDGE1-2.10
BRIDGE2B_OUT
  Top 0.254: BRIDGE2.1 22.35,27.94 BRIDGE1-2.11
BRIDGE3A_IN  (via drill 0.35)
  Top 0.254: H-BRIDGE-2A.P$4 33.85,48.45 34.88,49.48 39.45,49.48 v40.89,50.93 | v44.2,50.93 44.2,53.09 PCB2.4
  Bottom 0.254: v40.89,50.93 v44.2,50.93
BRIDGE3A_OUT  (via drill 0.35)
  Top 0.508: v35.69,46.86 36.32,47.5 BRIDGE3.2
  Bottom 0.508: v35.69,46.86 H-BRIDGE-2A.P$3
BRIDGE3B_IN
  Top 0.254: H-BRIDGE-2A.P$2 39.81,48.45 41.91,50.55 PCB2.5
BRIDGE3B_OUT
  Top 0.508: H-BRIDGE-2A.P$7 25.16,44.46 26.42,45.72 39.12,45.72 39.88,44.96 BRIDGE3.1
BRIDGE3C_IN
  Top 0.254: PCB2.6 35.92,49.89 31.23,49.89 27.59,46.25 25.5,46.25 23.7,44.45 H-BRIDGE-2A.P$9
BRIDGE3D_IN
  Top 0.254: H-BRIDGE-2A.P$6 29.21,48.45 31.06,50.3 35.44,50.3 36.83,51.69 PCB2.7
CS_SD  (via drill 0.35)
  Top 0.254: v65.28,39.12 62.04,39.12 58.29,35.36 56.01,35.36 53.78,37.59 v36.58,37.59 | v31.37,38.61 31.37,39.71 31.39,39.73 31.39,40.28 31.01,40.66 30.2,40.66 28.12,38.58 27.26,38.58 27.23,38.61 26.54,38.61 v26.29,38.35
  Bottom 0.254: PCB2.31 86.81,40.64 85.59,39.42 83.24,39.42 83.06,39.24 65.28,39.24 v65.28,39.12 | v36.58,37.59 32.38,37.59 v31.37,38.61 | v26.29,38.35 19.87,38.35 19.26,38.96 11.33,38.96 9.1,36.73 8.17,36.73 7.82,37.08 SD-WRITER.CS
GND  (via drill 0.35)
  Top 0.254: I2C5.2 I2C6.2 I2C_5V_1.2 I2C_5V_2.2 | I2C2.2 I2C3.2 | VIN3.P1 18.54,54.36 PCB2.GND | v18.92,21.08 18.92,16.64 3.3V-REGULATOR.GND | PCB2.GND.. v31.75,10.03
  Bottom 0.254: BRIDGE1-2.13 19.05,21.08 18.92,20.96 v18.92,21.08
  pour Bottom (isolate 0.254): 0,68.58 115.57,68.58 115.57,0 0,0
  pour Top (isolate 0.254): 0,68.58 115.57,68.58 115.57,0 0.13,0 0,0
LED1B
  Top 0.254: R21.1 85.72,44.45 85.85,44.32 85.85,44.14 86.31,43.69 86.31,39.42 PCB2.33
LED1G
  Bottom 0.254: PCB2.35 88.9,36.83 88.9,41.09 88.13,41.86 87.94,41.86 87.88,41.91 R20.1
LED1R
  Top 0.254: R22.1 83.87,48.77 84.59,49.48 88.13,49.48 88.85,48.77 88.85,48.69 89.15,48.39 89.15,37.59 88.39,36.83 86.36,36.83 PCB2.32
LED2B  (via drill 0.35)
  Top 0.254: PCB2.37 86.31,34.34 84.4,34.34 83.69,35.05 83.69,36.07 78.1,41.66 v78.1,44.96
  Bottom 0.254: R24.1 55.32,44.45 56.43,45.57 57.36,45.57 58.65,44.28 58.65,44.02 59.34,43.33 72.16,43.33 73.91,45.09 77.98,45.09 v78.1,44.96
LED2G  (via drill 0.35)
  Top 0.254: PCB2.36 85.09,33.08 83.29,34.88 83.29,35.2 v75.44,43.05 | v63.91,42.32 62.28,42.32 61.57,43.03 47.85,43.03 R23.1
  Bottom 0.254: v75.44,43.05 72.52,43.05 71.98,42.52 71.98,41.45 71.33,40.79 65.43,40.79 v63.91,42.32 63.8,42.42
LED2R  (via drill 0.35)
  Top 0.254: v78.23,46.23 79.63,44.83 79.63,41.02 PCB2.34
  Bottom 0.254: R25.1 55.57,49.28 56.69,48.16 69.57,48.16 71.5,46.23 v78.23,46.23
MISO  (via drill 0.35)
  Top 0.254: SPI1.5 SPI2.5 | SPI4.5 SPI3.5 | v51.82,63.5 51.31,63.5 49.71,61.77 4.29,61.65 2.54,59.9 2.54,43.23 5.08,40.69 SD-WRITER.MISO 5.08,38.56 4.04,37.52 4.04,36.65 5.11,35.58 5.51,35.58 6.53,34.57 6.53,28.4 6.73,28.19 6.73,27.64 7.54,26.83 7.54,26.81 7.57,26.34 9.4,24.51 12.02,24.51 12.78,23.76 12.78,22.98 12.7,22.9 v12.7,21.46 | v62.48,6.98 75.56,6.98 83.82,15.24 PCB2.50
  Bottom 0.254: SPI4.5 75.31,65.53 63.5,65.53 62.36,64.39 62.23,64.39 60.07,62.23 SPI2.5 58.14,64.03 56.97,64.03 56.44,63.5 v51.82,63.5 | v12.7,21.46 12.7,17.43 12.34,17.07 12.34,14.21 18.92,7.62 49.66,7.62 50.93,6.35 61.72,6.35 62.23,6.86 62.36,6.86 v62.48,6.98
MOSI  (via drill 0.35)
  Top 0.254: SPI1.4 SPI2.4 62.61,62.23 | SPI3.4 SPI4.4 78.97,64.03 75.26,64.03 75.24,64.01 70.56,64.01 70.53,64.03 64.59,64.03 62.79,62.23 62.61,62.23 | SD-WRITER.MOSI 5.08,45.77 2.95,47.91 2.95,59.73 4.46,61.24 52.6,61.24 56.39,65.02 60.96,65.02 62.61,62.23 | v6.6,40.77 6.6,40.32 7.34,39.58 7.34,29.62 10.11,26.85 12.23,26.85 13.59,25.48 13.59,23.37 v15.49,21.46 | v62.48,9.02 77.02,9.02 84.46,16.46 85.59,16.46 86.43,15.62 87.25,15.62 PCB2.51
  Bottom 0.254: SD-WRITER.MOSI 5.08,43.64 6.12,42.59 6.12,41.73 6.1,41.71 6.1,41.28 v6.6,40.77 | v15.49,21.46 16,21.46 20.57,16.89 20.57,10.79 22.86,8.51 54.92,8.51 56.01,7.42 60.88,7.42 v62.48,9.02
N$14
  Top 0.254: R20.2 LED1.1
N$20
  Top 0.254: R21.2 LED1.2
N$21
  Top 0.254: R22.2 70.1,49.53 LED1.4
N$22
  Top 0.254: R23.2 LED2.1
N$23
  Top 0.254: R24.2 LED2.2
N$24
  Top 0.254: R25.2 60.2,49.28 LED2.4
ON_IF_>3V
  Top 0.254: POT.P$2 13.17,17.49 16.51,20.83 16.51,23.62 COMPARATOR.2 14.99,29.72 9.65,29.72 8.64,30.73 R18.1
POWER-ON
  Top 0.254: CUTOFF.G 15.49,10.16 17.02,11.68 17.02,21.59 COMPARATOR.1
READ_ACT1
  Top 0.254: ACT-READ1.2 25.15,37.29 26.14,36.3 26.14,29.74 26.16,29.72 26.16,11.68 35.31,11.68 PCB2.A0
READ_ACT2
  Top 0.254: PCB2.A1 37.44,12.09 30.84,12.09 28.96,13.97 28.96,31.43 27.79,32.6 27.79,36.24 29.07,37.52 32.69,37.52 32.69,38.79 ACT-READ2.2
REG-3V3
  Top 0.254: 3.3V-REGULATOR.VOUT 19.81,14.99 19.81,21.84 20.57,22.61 20.57,26.67 COMPARATOR.3 18.03,29.21 18.03,29.46 9.91,37.59 9.91,38.35 8.64,39.62 R17.1
RX_GPS
  Bottom 0.254: GPS.RX 4.95,22.61 3.81,23.75 3.81,52 3.61,52.2 3.61,54.48 5.21,56.08 7.49,56.08 8.8,54.77 63.34,54.77 PCB2.16
RX_XBEE
  Top 0.254: XBEE.3 60.86,18.69 LOGIC-SHIFTER.A1
RX_XBEE5V
  Top 0.254: LOGIC-SHIFTER.B1 73.15,21.89 74.19,22.94 74.19,23.87 71.71,26.36 68.5,26.36 67.72,27.14 67.72,38.5 64.75,41.48 64.75,42.19 64.56,42.37 64.56,42.59 62.74,44.42 62.74,49.53 60.71,51.56 60.2,51.56 59.69,52.07 PCB2.14
SCK  (via drill 0.35)
  Top 0.254: SPI4.3 SPI3.3 | v69.09,60.2 68.86,60.43 67.13,60.43 65.33,62.23 SPI2.3 SPI1.3 61.67,54.56 41.4,54.56 41.33,54.48 39.95,54.48 39.88,54.56 36.32,54.56 32.47,50.7 27.98,50.7 26.15,48.88 26.15,48.25 v23.24,45.34 | v20.57,46.36 16.38,42.16 SD-WRITER.SCK 5.08,41.27 6.93,39.41 6.93,29.01 9.58,26.36 9.58,25.52 10.18,24.92 12.19,24.92 13.18,23.93 13.18,22.76 14.22,21.72 v14.22,21.46 | v62.48,8 v74.93,8
  Bottom 0.254: v69.09,60.2 74.23,60.2 74.51,59.92 81.31,59.92 SPI3.3 | v20.57,46.36 22.23,46.36 v23.24,45.34 | v14.22,21.46 14.22,12.89 19.08,8.03 50.01,8.03 51.18,6.86 61.47,6.86 61.6,6.98 61.6,7.24 62.23,7.87 62.36,7.87 v62.48,8 | v74.93,8 80.39,8 PCB2.52
SCL
  Bottom 0.254: PCB2.21 78.54,54.41 78.54,54.48 80.14,56.08 82.42,56.08 82.49,56.01 86.7,56.01 87.36,55.35 87.53,55.35 93.22,49.66 93.22,27.69 MULTIPLEXER.SCL
SCL3V_1  (via drill 0.35)
  Top 0.254: I2C1.4 96.27,59.89 93.19,56.81 93.19,32.56 92.38,31.76 92.38,14.3 95,11.68 MULTIPLEXER.SCL0 | v98.81,9.52 104.78,9.52 106.58,7.72 106.58,5.12 107.23,4.47 110.97,4.47 R10.1
  Bottom 0.254: MULTIPLEXER.SCL0 95.95,10.67 97.07,9.55 98.78,9.55 v98.81,9.52
SCL3V_2  (via drill 0.35)
  Top 0.254: I2C2.4 100.84,60.83 103.12,63.12 R12.1 | v93.09,58.8 93.09,57.87 91.57,56.34 91.57,9.02 MULTIPLEXER.SCL1
  Bottom 0.254: I2C2.4 99.08,60.2 97.63,61.65 94.85,61.65 93.7,60.49 93.7,59.41 v93.09,58.8
SCL3V_3
  Top 0.254: R2.1 MULTIPLEXER.SCL2
  Bottom 0.254: MULTIPLEXER.SCL2 110.24,9.2 112.29,11.25 112.29,60.12 111.17,61.24 108.79,61.24 107.75,60.2 I2C3.4
SCL3V_4
  Top 0.254: R5.1 MULTIPLEXER.SCL3
  Bottom 0.254: I2C4.4 109.98,59.94 111.89,58.04 111.89,14.86 MULTIPLEXER.SCL3
SCL3V_5
  Top 0.254: R7.1 MULTIPLEXER.SCL4
  Bottom 0.254: R7.1 107.7,19.25 106.58,20.36 106.58,22.07 104.78,23.88 104.78,35.94 103,37.72 99.69,37.72 98.81,38.61 98.81,43.94 I2C5.4
SCL3V_6
  Top 0.254: R8.1 MULTIPLEXER.SCL5
  Bottom 0.254: R8.1 107.7,24.33 105.77,26.26 105.77,36.35 104.29,37.82 104.22,37.82 103.61,38.43 103.61,43.71 I2C6.4
SCL5V_1
  Top 0.254: R14.1 MULTIPLEXER.SCL6
  Bottom 0.254: I2C_5V_1.4 107.7,44.2 107.7,35.11 106.58,33.99 106.58,30.53 107.7,29.41 R14.1
SCL5V_2
  Top 0.254: R16.1 MULTIPLEXER.SCL7
  Bottom 0.254: R16.1 108.2,34.04 108.2,38.41 108.18,38.43 108.18,44.68 I2C_5V_2.4
SDA  (via drill 0.35)
  Top 0.254: PCB2.20 74.93,53.47 77.47,56.01 80.07,56.01 80.14,56.08 82.42,56.08 82.49,56.01 v87.63,56.01
  Bottom 0.254: v87.63,56.01 93.73,49.91 93.73,29.72 MULTIPLEXER.SDA
SDA3V_1
  Top 0.254: I2C1.3 93.59,54.98 93.59,32.39 92.79,31.59 92.79,25.31 93.73,24.37 93.73,14.48 MULTIPLEXER.SDA0 95,12.26 96.04,11.22 96.04,7.7 96.01,7.67 96.01,6.04 96.04,6.02 96.04,4.85 94.11,2.92 R9.1
SDA3V_2  (via drill 0.35)
  Top 0.254: v94.11,58.8 94.11,58.31 91.97,56.17 91.97,11.15 MULTIPLEXER.SDA1
  Bottom 0.254: 100.84,57.53 100.84,57.35 102.64,55.55 102.64,52.58 103.17,52.58 104.22,51.54 105.94,51.54 R11.1 | 100.84,57.53 I2C2.3 | 100.84,57.53 98.07,60.3 98.07,60.63 97.46,61.24 95.02,61.24 94.11,60.33 v94.11,58.8
SDA3V_3
  Top 0.254: R1.1 MULTIPLEXER.SDA2 112.85,8.2 112.85,32.76 112.86,32.77 112.86,32.85 | I2C3.3 107.75,57.66 108.79,58.7 111.17,58.7 112.29,57.58 112.29,42.69 112.83,42.12 112.83,42.11 112.83,42.1 112.84,42.09 112.83,41.94 112.85,40.59 112.85,40.42 112.85,33.02 112.86,32.85 | 112.86,32.85
SDA3V_4
  Top 0.254: R3.1 MULTIPLEXER.SDA3 111.89,12.32 111.89,32.37 112.45,32.93 112.45,33.01 112.45,33.17 112.45,40.42 112.42,41.94 112.42,41.95 111.89,42.52 111.89,55.75 I2C4.3
SDA3V_5
  Top 0.254: R4.1 MULTIPLEXER.SDA4
  Bottom 0.254: I2C5.3 96.27,43.69 98.3,41.66 98.3,38.48 99.57,37.21 102.74,37.21 104.27,35.69 104.27,23.62 106.04,21.84 106.04,17.4 R4.1
SDA3V_6
  Top 0.254: R6.1 MULTIPLEXER.SDA5
  Bottom 0.254: I2C6.3 102.74,43.94 103.12,43.56 103.12,38.34 104.05,37.41 104.06,37.41 105.28,36.19 105.28,24 107.7,21.59 R6.1
SDA5V_1
  Top 0.254: R13.1 MULTIPLEXER.SDA6
  Bottom 0.254: I2C_5V_1.3 105.41,43.64 107.21,41.83 107.21,40.97 107.19,40.94 107.19,39.32 107.21,39.29 107.21,35.2 106.17,34.16 106.17,28.39 107.7,26.87 R13.1
SDA5V_2
  Top 0.254: I2C_5V_2.3 112.01,41.78 112.01,35.05 112.04,33.17 112.04,33.1 111.43,32.49 109.19,32.49 R15.1 MULTIPLEXER.SDA7
SS1  (via drill 0.35)
  Top 0.254: v91.19,59.06 91.19,56.54 91.16,56.51 91.16,17.63 v90.17,16.64
  Bottom 0.254: SPI1.6 56.53,57.91 54.22,60.22 53.32,60.22 50.29,63.25 50.29,64.9 51.43,66.04 87.88,66.04 91.06,62.87 91.06,59.18 v91.19,59.06 | PCB2.46 86.41,19 88.13,19 88.85,18.29 88.85,17.96 v90.17,16.64
SS2  (via drill 0.35)
  Top 0.254: PCB2.47 86.41,19.1 86.41,17.28 87,16.69 87,16.51 87.05,16.56 88.13,16.56 90.32,18.75 90.32,63.54 88.54,65.32 62.69,65.32 62.48,65.53 55.75,65.53 52.83,62.61 52.83,62.48 v52.71,62.36
  Bottom 0.254: v52.71,62.36 57.28,62.36 SPI2.6
SS3
  Top 0.254: PCB2.48 80,22.87 80,37.47 73.71,43.76 73.71,53.84 75.69,55.83 SPI3.6
SS4  (via drill 0.35)
  Top 0.254: v73.79,64.67 88.62,64.67 89.92,63.37 89.92,20.07 PCB2.49
  Bottom 0.254: 75.69,62.36 SPI4.6 74.68,62.23 73.79,63.12 v73.79,64.67
SWITCH1_IN
  Bottom 0.254: SWITCH1-FET.G 71.64,32.77 74.84,29.57 74.84,26.37 75.62,25.6 80.21,25.6 PCB2.38
SWITCH1_LOW
  Top 0.508: SWITCH1.2 72.9,35.31 72.9,30.48 72.64,30.23 SWITCH1-FET.D
SWITCH2_HIGH
  Top 0.508: SWITCH2.1 74.93,36.32 73.66,35.05 73.66,28.7 75.44,26.92 SWITCH2-FET.S
SWITCH2_IN
  Bottom 0.254: PCB2.39 86.81,30.48 85.59,31.7 77.52,31.7 SWITCH2-FET.G
TX_GPS
  Bottom 0.254: GPS.TX 5.08,21.13 3.2,23.01 3.2,54.64 5.05,56.49 7.66,56.49 8.97,55.18 65.47,55.18 PCB2.17
TX_XBEE
  Top 0.254: 62.94,18.34 LOGIC-SHIFTER.A2 61.4,16.69 XBEE.2
TX_XBEE5V
  Top 0.254: LOGIC-SHIFTER.B2 73.15,19.36 79.59,25.8 79.59,32.55 76.99,35.16 76.99,39.91 68.41,48.49 65.35,48.49 64.75,49.1 64.75,50.83 PCB2.15
VCC  (via drill 0.35)
  Top 0.254: 3.3V-REGULATOR.VIN 14.99,7.62 CUTOFF.D 11.68,7.62 10.16,9.14 10.16,10.92 12.7,13.46 12.7,15.75 10.67,17.78 POT.P$1 11.18,19.73 COMPARATOR.8 8.64,23.37 7.24,24.76 6.88,26.26 4.65,26.64 1.88,29.41 v1.88,56.77 | 4.32,57.53 4.32,57.4 3.68,56.77 v3.6,56.77
  Top 0.508: VIN3.P2 14.48,60.71 11.68,60.71 VIN2.P2 8.64,60.71 5.33,60.71 4.32,59.69 VIN1.P2 4.32,57.53 4.32,55.37 3.48,54.53 3.48,49.73 4.6,48.62 5.68,48.62 8.88,51.82 15.7,51.82 H-BRIDGE-2A.P$10
  Bottom 0.254: v3.6,56.77 v1.88,56.77
  Bottom 0.508: H-BRIDGE-2A.P$10 21.49,48.45 22.65,47.29 26.38,47.29 H-BRIDGE-2A.P$5 29.22,37.22 28.55,36.55 28.55,34.06 29.23,33.38 29.62,33.38 BRIDGE1-2.8 35.13,34.62 35.13,34.81 37.47,34.81 38.74,36.07 38.74,38.73 40.51,40.51 40.83,40.51 43.47,43.16 57.41,43.16 58.14,42.43 58.14,41.17 62.48,36.83 SWITCH1.1 70.87,34.8 72.39,34.8 74.68,32.51 74.68,30.48 75.69,29.46 SWITCH2-FET.D
VCCINT
  Top 0.254: CUTOFF.S 16.76,5.08 18.54,3.05 35.05,3.05 PCB2.VIN